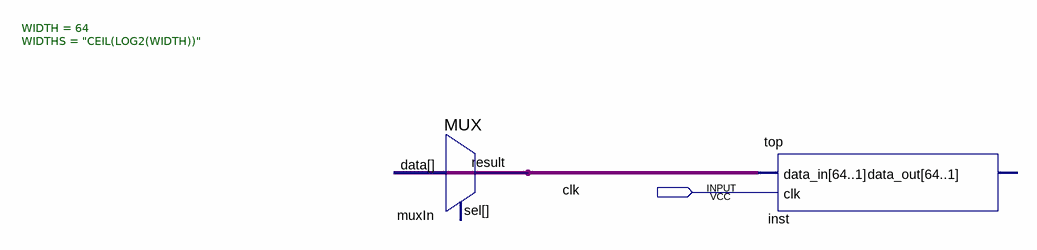
[diagram p0: schematic sheet]
// Quartus schematic Encoder1.bdf as structural Verilog: 2 symbols, 1 pins
module Encoder1 (
  input  clk
);

  wire [63:0] muxIn_result;

  MUX #(.WIDTH(64), .WIDTHS("CEIL(LOG2(WIDTH))")) muxIn (.data(muxIn_result), .result(muxIn_result));  // open: sel
  top inst (.data_in(muxIn_result), .clk(clk));  // open: data_out
endmodule
